# EAGLE design YamakenMusicPlayer (EAGLE 9.3.1)
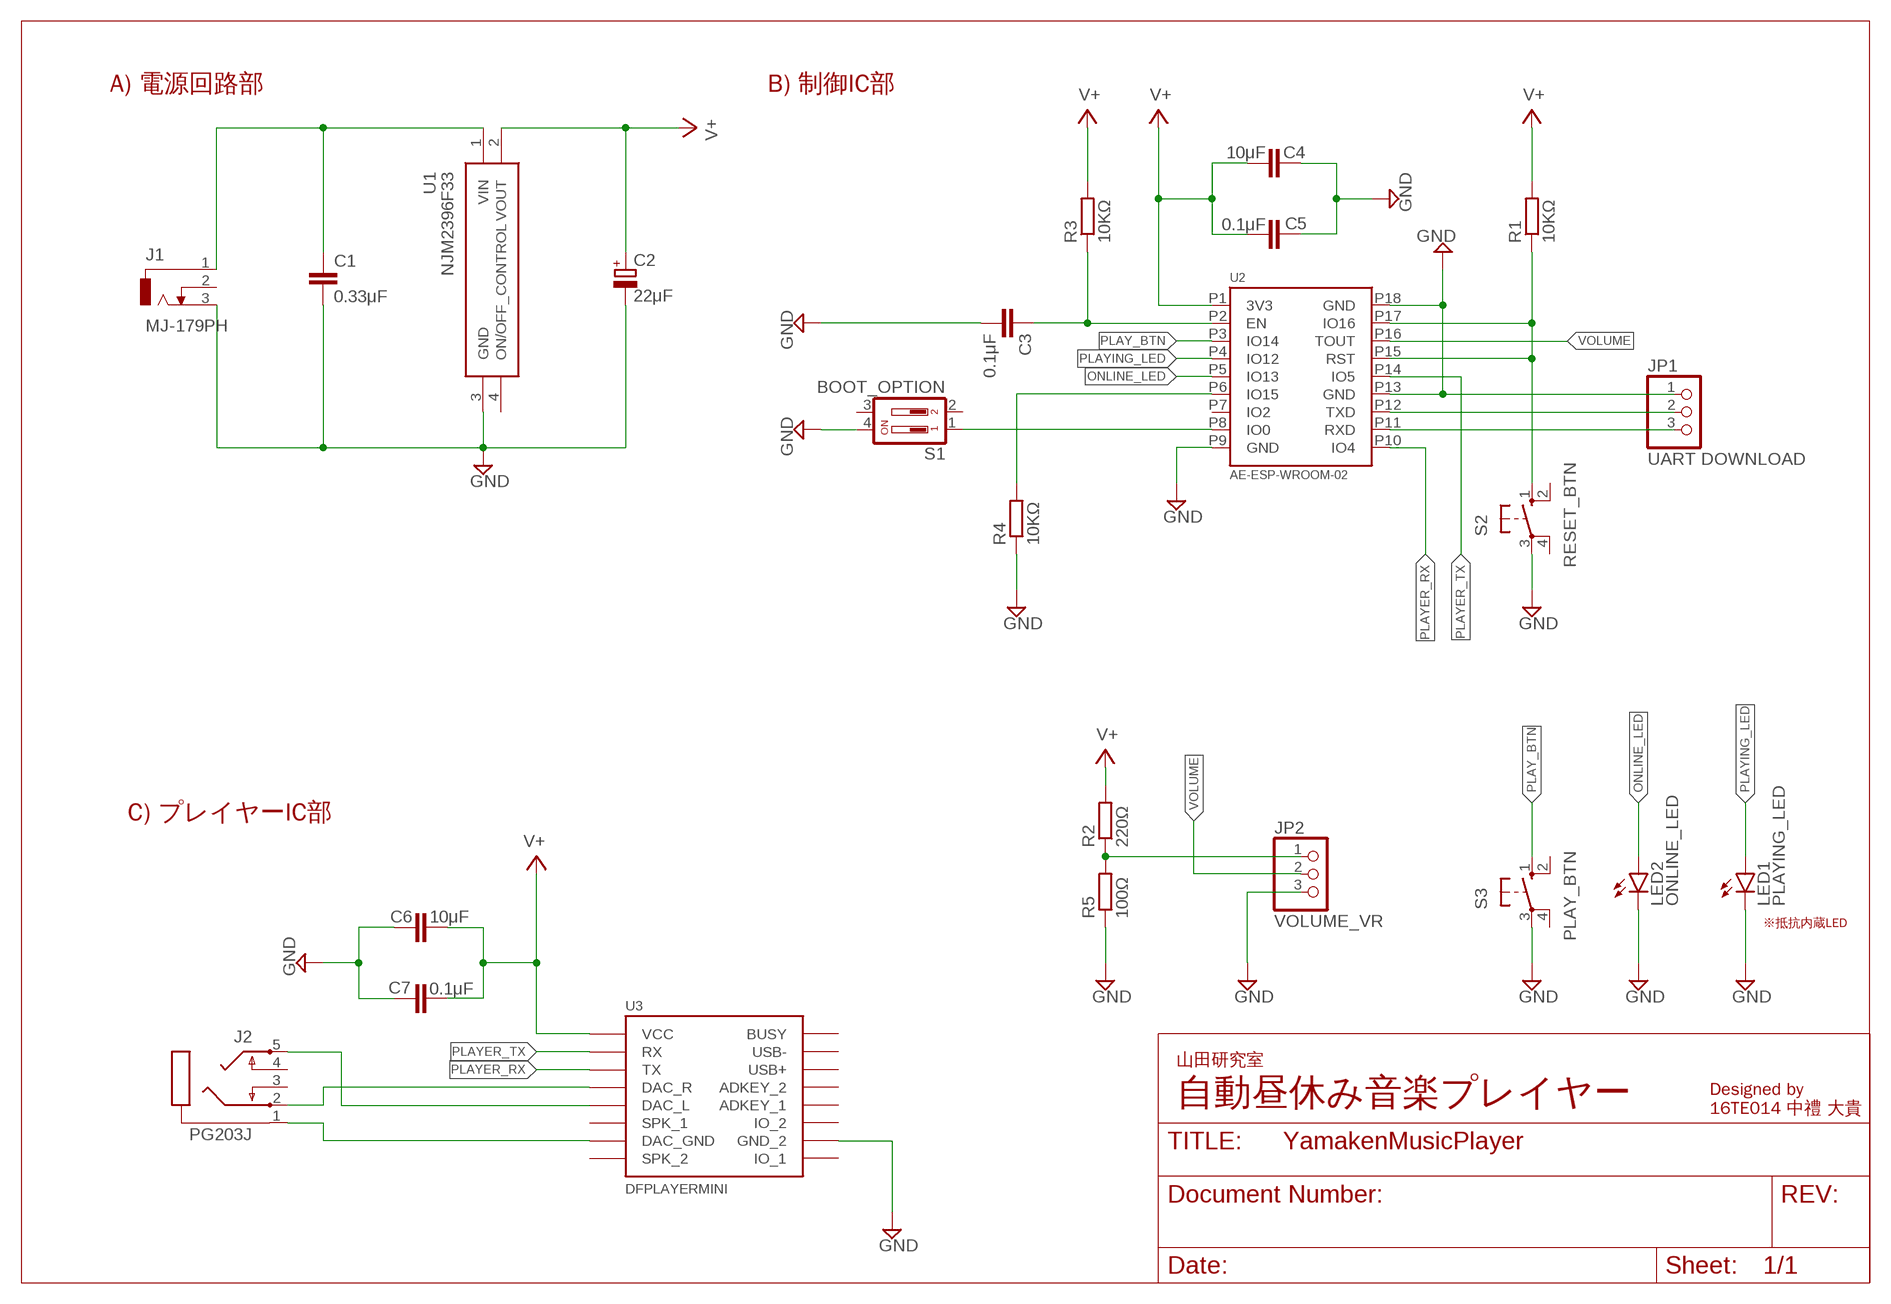
[diagram p0: schematic, sheet 1]
FRAME1 (DINA4_L): SPICEPREFIX: X

## Parts
C1  0.33μF  C-EU050-024X044  [C050-024X044]
C2  22μF  CPOL-EUE2.5-7  [E2,5-7]
C3  0.1μF  C-EU050-024X044  [C050-024X044]
C4  10μF  C-EU050-024X044  [C050-024X044]
C5  0.1μF  C-EU050-024X044  [C050-024X044]
C6  10μF  C-EU050-024X044  [C050-024X044]
C7  0.1μF  C-EU050-024X044  [C050-024X044]
J1  MJ-179PH  DCJ0202  [DCJ0202]
J2  PG203J  [PG203J]
JP1  UART DOWNLOAD  PINHD-1X3  [1X03]
JP2  VOLUME_VR  PINHD-1X3  [1X03]
LED1  PLAYING_LED  LED5MM  [LED5MM]
LED2  ONLINE_LED  LED5MM  [LED5MM]
R1  10KΩ  R-EU_0207/10  [0207/10]
R2  220Ω  R-EU_0207/10  [0207/10]
R3  10KΩ  R-EU_0207/10  [0207/10]
R4  10KΩ  R-EU_0207/10  [0207/10]
R5  100Ω  R-EU_0207/10  [0207/10]
S1  BOOT_OPTION  DIP02YL  [DIP02YL]
S2  RESET_BTN  10-XX  [B3F-10XX]
S3  PLAY_BTN  10-XX  [B3F-10XX]
U1  NJM2396F33  [TO254P480X1000X1900-4P]
U2  AE-ESP-WROOM-02  [AE-ESP-WROOM-02]
U3  DFPLAYERMINI  [DFPLAYERMINI]

## Nets
+12V [power]: C1.1 J1.1 U1.1(VIN)
DAC_GND: J2.1 U3.GND_1(DAC_GND)
DAC_R: J2.2 U3.DAC_R
GND [power]: C1.2 C2.- C3.2 C4.1 C5.1 C6.1 C7.1 J1.3 JP1.1 JP2.3 LED1.K(C) LED2.K(C) R4.1 R5.1 S1.4 S2.3(P) S3.3(P) U1.3(GND) U2.P9(GND) U2.P13(GND) U2.P18(GND) U3.GND_2
N$1: R1.1 S2.1(S) U2.P15(RST) U2.P17(IO16)
N$2: J2.5 U3.DAC_L
N$3: C3.1 R3.1 U2.P2(EN)
N$4: S1.1 U2.P8(IO0)
N$5: R4.2 U2.P6(IO15)
N$6: JP1.2 U2.P12(TXD)
N$7: JP1.3 U2.P11(RXD)
N$12: JP2.1 R2.1 R5.2
ONLINE_LED: LED2.A U2.P5(IO13)
PLAY_BTN: S3.1(S) U2.P3(IO14)
PLAYER_RX: U2.P10(IO4) U3.TX
PLAYER_TX: U2.P14(IO5) U3.RX
PLAYING_LED: LED1.A U2.P4(IO12)
V+ [power]: C2.+ C4.2 C5.2 C6.2 C7.2 R1.2 R2.2 R3.2 U1.2(VOUT) U2.P1(3V3) U3.VCC
VOLUME: JP2.2 U2.P16(TOUT)
Unconnected: J1.2 J2.3 J2.4 S1.2 S1.3 S2.2(S1) S2.4(P1) S3.2(S1) S3.4(P1) U1.4(ON/OFF_CONTROL) U2.P7(IO2) U3.ADKEY1(ADKEY_1) U3.ADKEY2(ADKEY_2) U3.BUSY U3.IO1(IO_1) U3.IO2(IO_2) U3.SPK1(SPK_1) U3.SPK2(SPK_2) U3.USB+ U3.USB-

## Notes on the sheet
- A) 電源回路部 | B) 制御IC部
- C) プレイヤーIC部
- ※抵抗内蔵LED
- 山田研究室
- 自動昼休み音楽プレイヤー
- Designed by
  16TE014 中禮 大貴

## Library data of the parts
C1 C3-C7 = rcl:C-EU: CAPACITOR, European symbol; SPICEPREFIX: C
C2 = rcl:CPOL-EU: POLARIZED CAPACITOR, European symbol; SPICEPREFIX: C
J1 = con-jack:DCJ0202: DC POWER JACK Source: DCJ0202.pdf; OC_FARNELL: unknown; OC_NEWARK: unknown
J2 = con-hirschmann:PG203J: MIC/HEADPHONE JACK KS-S stereo microphone/headphone jack PG203JN (Schukat); OC_FARNELL: unknown; OC_NEWARK: unknown
JP1 JP2 = pinhead:PINHD-1X3: PIN HEADER
LED1 LED2 = led:LED: LED OSRAM: - CHIPLED LG R971, LG N971, LY N971, LG Q971, LY Q971, LO R971, LY R971 LH N974, LH R974 LS Q976, LO Q976, LY Q976 LO Q996 - Hyper CHIPLED LW Q18S LB Q993, LB Q99A, LB R99A - SideLED LS A670, LO A670, LY A670, LG A670, LP A670 LB A673, LV A673, LT A673, LW A673 LH A674 LY A675 LS A676, LA A676, LO A676, LY A676, LW A676 LS A679, LY A679, LG A679 - Hyper Micro SIDELED® LS Y876, LA Y876, LO Y876, LY Y876 LT Y87S - SmartLED LW L88C, LW L88S LB L89C, LB L89S, LG L890 LS L89K, LO L89K, LY L89K LS L896, LA L896, LO L896, LY L896 - TOPLED LS T670, LO T670, LY T670, LG T670, LP T670 LSG T670, LSP T670, LSY T670, LOP T670, LYG T670 LG T671, LOG T671, LSG T671 LB T673, LV T673, LT T673, LW T673 LH T674 LS T676, LA T676, LO T676, LY T676, LB T676, LH T676, LSB T676, LW T676 LB T67C, LV T67C, LT T67C, LS T67K, LO T67K, LY T67K, LW E67C LS E67B, LA E67B, LO E67B, LY E67B, LB E67C, LV E67C, LT E67C LW T67C LS T679, LY T679, LG T679 LS T770, LO T770, LY T770, LG T770, LP T770 LB T773, LV T773, LT T773, LW T773 LH T774 LS E675, LA E675, LY E675, LS T675 LS T776, LA T776, LO T776, LY T776, LB T776 LHGB T686 LT T68C, LB T68C - Hyper Mini TOPLED® LB M676 - Mini TOPLED Santana® LG M470 LS M47K, LO M47K, LY M47K Source: http://www.osram.convergy.de LUXEON: - LUMILED® LXK2-PW12-R00, LXK2-PW12-S00, LXK2-PW14-U00, LXK2-PW14-V00 LXK2-PM12-R00, LXK2-PM12-S00, LXK2-PM14-U00 LXK2-PE12-Q00, LXK2-PE12-R00, LXK2-PE12-S00, LXK2-PE14-T00, LXK2-PE14-U00 LXK2-PB12-K00, LXK2-PB12-L00, LXK2-PB12-M00, LXK2-PB14-N00, LXK2-PB14-P00, LXK2-PB14-Q00 LXK2-PR12-L00, LXK2-PR12-M00, LXK2-PR14-Q00, LXK2-PR14-R00 LXK2-PD12-Q00, LXK2-PD12-R00, LXK2-PD12-S00 LXK2-PH12-R00, LXK2-PH12-S00 LXK2-PL12-P00, LXK2-PL12-Q00, LXK2-PL12-R00 Source: www.luxeon.com KINGBRIGHT: KA-3528ASYC Source: www.kingbright.com
R1-R5 = rcl:R-EU_: RESISTOR, European symbol; SPICEPREFIX: R
S1 = switch-dil:DIP02YL: DIL/CODE SWITCH; OC_FARNELL: unknown; OC_NEWARK: unknown
S2 S3 = switch-omron:10-XX: OMRON SWITCH; MPN: B3F-1000; OC_FARNELL: 176432; OC_NEWARK: 36M3542
U1 = SamacSys_Parts:NJM2396F33: LOW DROPOUT VOLTAGE REGULATOR WITH ON/OFF CONTROL Source: Datasheet <http://www.njr.com/semicon/PDF/NJM2396_E.pdf>; DESCRIPTION: LOW DROPOUT VOLTAGE REGULATOR WITH ON/OFF CONTROL; HEIGHT: 4.8mm; MANUFACTURER_NAME: New Japan Radio; MANUFACTURER_PART_NUMBER: NJM2396F33; RS_PART_NUMBER: 1782325; RS_PRICE-STOCK: http://uk.rs-online.com/web/p/products/1782325
U2 = ae-esp-wroom:AE-ESP-WROOM-02
U3 = DFPlayer_v1:DFPLAYERMINI

## Net classes
0 default: width 0.508 mm, clearance 0.508 mm
1 power: width 0.762 mm, clearance 0.508 mm

## Board
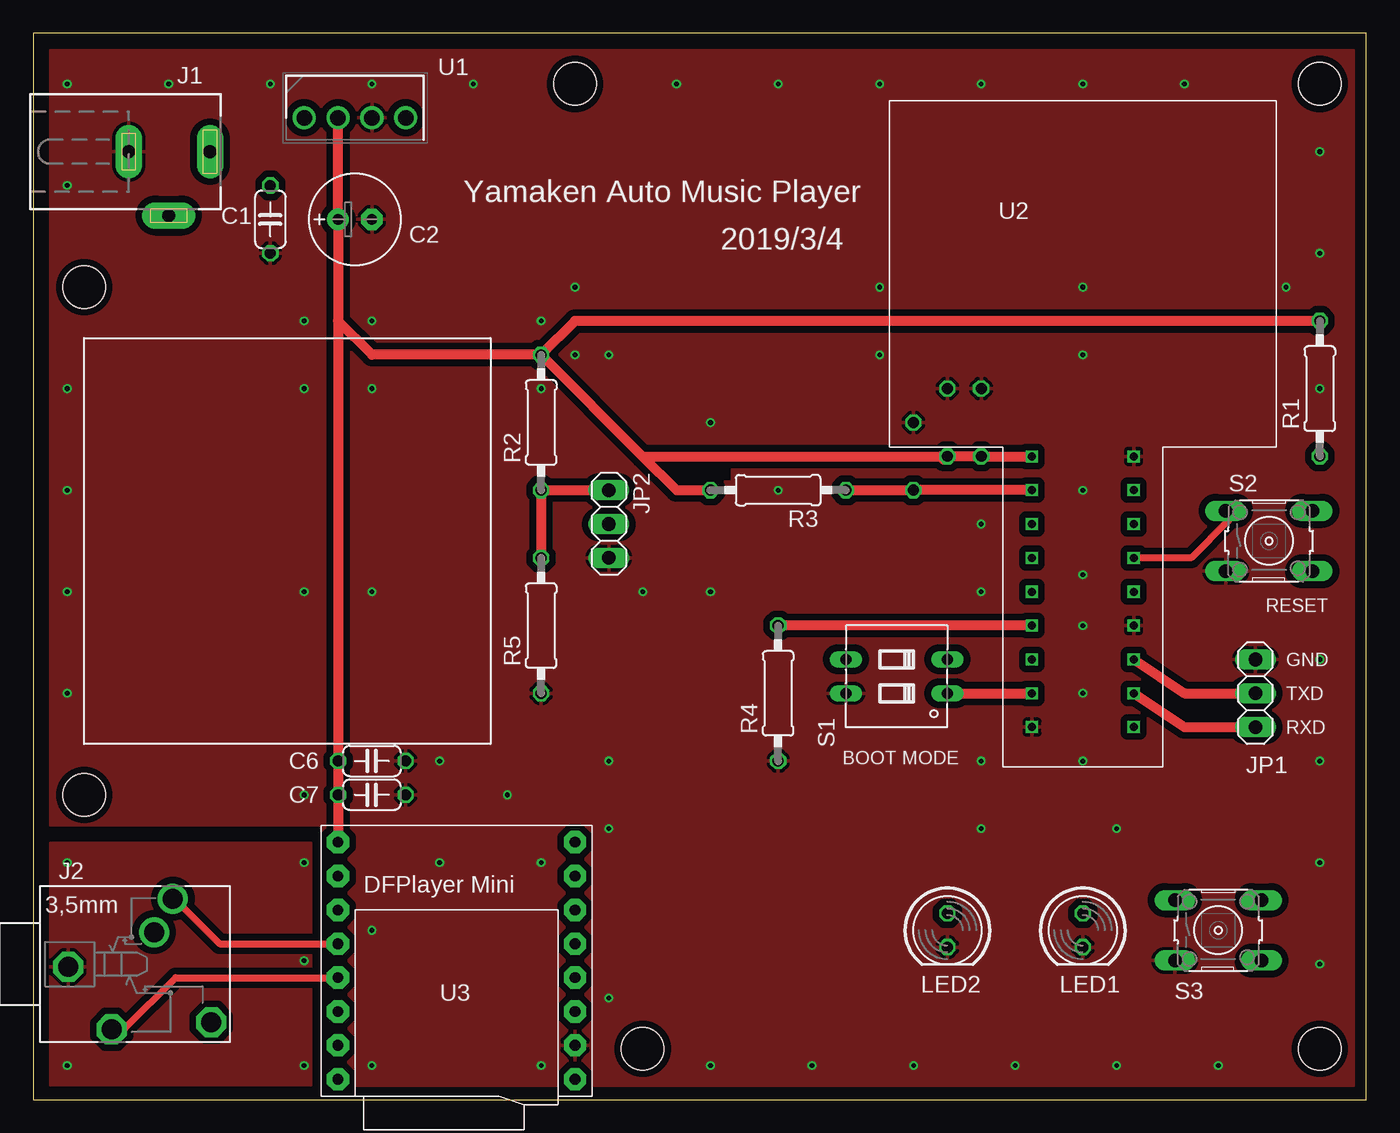
[diagram p1: board, top side]
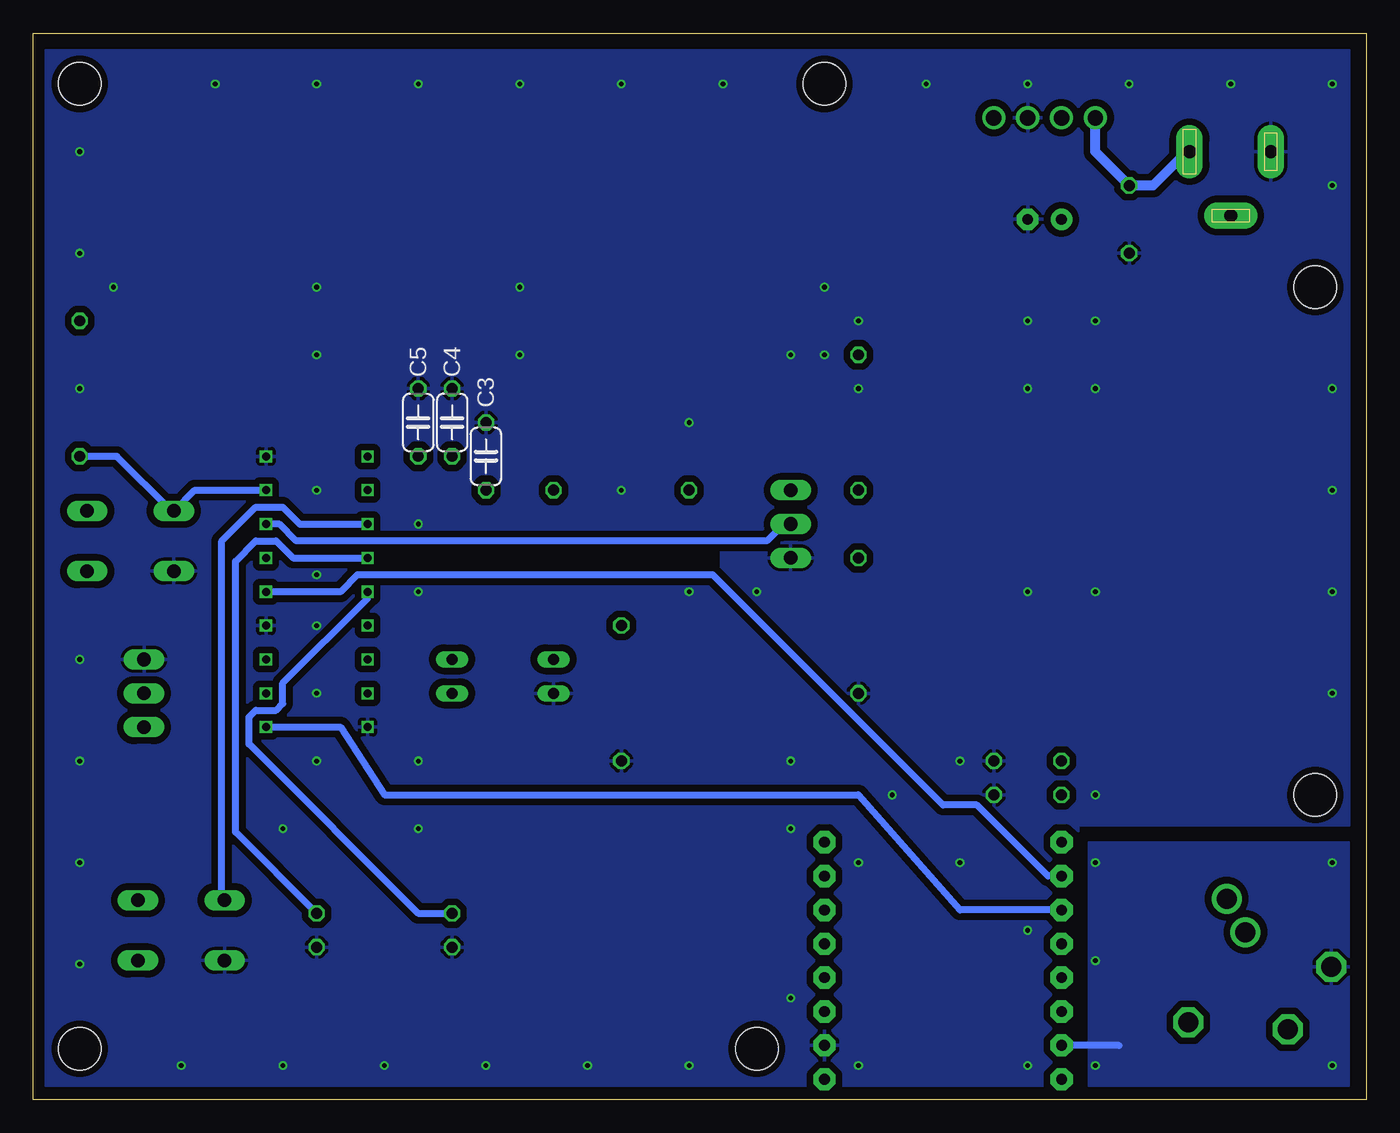
[diagram p2: board, bottom side, seen from below]

Size 100 x 80 mm. Coordinates in mm from the lower left corner, seen from the top.
Outline: 0,0 100,0 100,80 0,80 0,0
Copper layers (1*16): Top 0.035mm / dielectric 1.6mm / Bottom 0.035mm
Design rules "Elecrow_2-layer_PCB_eagle_rule": minimum track width 6mil, minimum drill 12mil, track to track 6mil, track to pad 6mil, pad to pad 6mil, via to via 8mil, smd to smd 0mil, copper to edge 20mil, drill to drill 10mil, minimum pad ring 6mil, minimum via ring 6mil, stop-mask expansion 0mil, vias tented up to drill 100mil, thermal gap 10mil
Holes 3.2 mm at 96.52,76.2 3.81,60.96 45.72,3.81 3.81,22.86 40.64,76.2 96.52,3.81
tRestrict: area 48,46.5 to 52.3,47.5
bRestrict: area 48.5,39.9 to 74.2,41.4

### Footprints (pad centres in the part's own frame; a part is rotated, then mirrored left to right if it is on the bottom)
C050-024X044 = drill 0.813 octagon: 1 -2.54,0; 2 2.54,0
E2,5-7 = drill 0.813 pad 1.6: + -1.27,0 | drill 0.813 pad 1.6 octagon: - 1.27,0
DCJ0202 = drill 1 pad 2 long: 1 0,3.1; 2 4.8,0; 3 0,-3
PG203J = drill 1.499 octagon: 1 -5.004,-0.203; 4 5.74,-4.369; 5 -1.753,-4.902 | drill 1.499: 2 2.845,4.902; 3 1.448,2.388
1X03 = drill 1.016 long: 1 -2.54,0; 2 0,0; 3 2.54,0
LED5MM = drill 0.813 octagon: A -1.27,0; K 1.27,0
0207/10 = drill 0.813 octagon: 1 -5.08,0; 2 5.08,0
DIP02YL = drill 0.813 long: 1 -1.27,-3.81; 2 1.27,-3.81; 3 1.27,3.81; 4 -1.27,3.81
B3F-10XX = drill 1.016 long: 1 -3.251,2.261; 2 3.251,2.261; 3 -3.251,-2.261; 4 3.251,-2.261
TO254P480X1000X1900-4P = drill 1.16 pad 1.74: 1 0,0; 2 2.54,0; 3 5.08,0; 4 7.62,0
AE-ESP-WROOM-02 = drill 0.6 pad 0.9 square: P1 -3.81,20.32; P2 -3.81,17.78; P3 -3.81,15.24; P4 -3.81,12.7; P5 -3.81,10.16; P6 -3.81,7.62; P7 -3.81,5.08; P8 -3.81,2.54; P9 -3.81,0; P10 3.81,0; P11 3.81,2.54; P12 3.81,5.08; P13 3.81,7.62; P14 3.81,10.16; P15 3.81,12.7; P16 3.81,15.24; P17 3.81,17.78; P18 3.81,20.32
DFPLAYERMINI = drill 0.8 pad 1.676 octagon: ADKEY1 8.89,-1.27; ADKEY2 8.89,1.27; BUSY 8.89,8.89; DAC_L -8.89,-1.27; DAC_R -8.89,1.27; GND_1 -8.89,-6.35; GND_2 8.89,-6.35; IO1 8.89,-8.89; IO2 8.89,-3.81; RX -8.89,6.35; SPK1 -8.89,-3.81; SPK2 -8.89,-8.89; TX -8.89,3.81; USB+ 8.89,3.81; USB- 8.89,6.35; VCC -8.89,8.89

### Placement (x,y rotation side)
C1  17.78,66.04 270 top
C2  24.13,66.04 0 top
C3  66.04,48.26 90 bottom
C4  68.58,50.8 270 bottom
C5  71.12,50.8 270 bottom
C6  25.4,25.4 180 top
C7  25.4,22.86 180 top
J1  10.16,71.12 270 top
J2  7.62,10.16 0 top
JP1  91.69,30.48 270 top
JP2  43.18,43.18 270 top
LED1  78.74,12.7 270 top
LED2  68.58,12.7 270 top
R1  96.52,53.34 90 top
R2  38.1,50.8 90 top
R3  55.88,45.72 180 top
R4  55.88,30.48 90 top
R5  38.1,35.56 90 top
S1  64.77,31.75 90 top
S2  92.71,41.91 0 top
S3  88.9,12.7 0 top
U1  20.32,73.66 0 top
U2  78.74,27.94 0 top
U3  31.75,10.41 0 top

### Tracks (layer width: path | path; a pad name or v marks a point on that pad's centre or on a via)
+12V
  Bottom 0.762: J1.1 13.46,71.12 16,68.58 C1.1 20.32,71.12 U1.1
DAC_GND  (via drill 0.35)
  Bottom 0.508: 18.54,4.06 U3.GND_1
  other vias: 20.32,10.41 20.32,2.54 20.32,17.78 2.54,17.78 2.54,2.54
  pour Top: 1.27,19.3 20.83,19.3 20.83,1.02 1.27,1.02
  pour Bottom: 1.27,19.3 20.83,19.3 20.83,1.02 1.27,1.02
DAC_R
  Top 0.508: U3.DAC_R 13.97,11.68 10.67,14.99 J2.2
GND  (via drill 0.35)
  other vias: 25.4,58.42 78.74,45.72 78.74,35.56 78.74,25.4 50.8,38.1 71.12,38.1 78.74,30.48 35.56,22.86 93.98,60.96 25.4,53.34 43.18,55.88 30.48,17.78 38.1,17.78 25.4,12.7 25.4,2.54 38.1,2.54 43.18,20.32 81.28,20.32 38.1,53.34 50.8,50.8 63.5,55.88 20.32,58.42 20.32,53.34 40.64,55.88 30.48,25.4 63.5,60.96 2.54,30.48 2.54,38.1 2.54,45.72 2.54,53.34 2.54,68.58 2.54,76.2 10.16,76.2 17.78,76.2 25.4,76.2 33.02,76.2 48.26,76.2 55.88,76.2 63.5,76.2 71.12,76.2 78.74,76.2 86.36,76.2 96.52,71.12 96.52,63.5 96.52,53.34 96.52,33.02 96.52,25.4 96.52,10.16 88.9,2.54 81.28,2.54 73.66,2.54 66.04,2.54 58.42,2.54 50.8,2.54 20.32,22.86 20.32,38.1 25.4,38.1 45.72,38.1 71.12,20.32 71.12,25.4 43.18,25.4 78.74,39.37 78.74,55.88 78.74,60.96 38.1,58.42 96.52,17.78 43.18,7.62 40.64,60.96 55.88,45.72 71.12,43.18
  pour Top: 1.27,78.74 1.27,20.57 21.59,20.57 21.59,1.02 99.06,1.02 99.06,78.74
  pour Bottom: 1.27,78.74 1.27,20.57 21.59,20.57 21.59,1.02 99.06,1.02 99.06,78.74
  pour Top: 76.2,50.8 81.28,50.8 81.28,25.4 76.2,25.4
  pour Top: 25.4,20.32 25.4,2.54 38.1,2.54 38.1,20.32
N$1
  Top 0.508: U2.P15 86.87,40.64 89.66,43.43 89.66,43.94 S2.1
  Bottom 0.508: U2.P17 87.88,45.72 89.41,44.2 S2.1 89.66,44.2 93.73,48.26 R1.1
N$2
  Top 0.508: U3.DAC_L 10.67,9.14 6.86,5.33 6.1,5.33 J2.5
N$3
  Top 0.762: U2.P2 C3.1 R3.1
N$4
  Top 0.762: S1.1 U2.P8
N$5
  Top 0.762: U2.P6 R4.2
N$6
  Top 0.762: U2.P12 86.36,30.48 JP1.2
N$7
  Top 0.762: U2.P11 86.36,27.94 JP1.3
N$12
  Top 0.762: R5.2 R2.1 JP2.1
ONLINE_LED
  Bottom 0.508: U2.P5 74.93,37.59 81.28,31.24 81.28,29.72 81.79,29.21 83.31,29.21 83.82,28.7 83.82,26.67 71.12,13.97 LED2.A
PLAY_BTN
  Bottom 0.508: U2.P3 80.01,43.18 81.28,44.45 83.31,44.45 85.85,41.91 85.85,14.99 S3.1
PLAYER_RX
  Bottom 0.508: U2.P10 76.96,27.94 73.66,22.86 38.1,22.86 30.48,14.22 U3.TX
PLAYER_TX
  Bottom 0.508: U2.P14 76.96,38.1 75.69,39.37 49.02,39.37 31.75,22.1 29.21,22.1 23.88,16.76 U3.RX
PLAYING_LED
  Bottom 0.508: U2.P4 80.52,40.64 81.79,41.91 83.31,41.91 84.84,40.39 84.84,20.07 LED1.A
V+
  Top 0.762: 22.86,58.42 C2.+ U1.2 | U2.P1 C5.2 C4.2 68.33,48.01 68.07,48.26 45.72,48.26 | R2.2 45.72,48.26 | R1.2 40.64,58.42 R2.2 | 22.86,58.42 C6.2 C7.2 U3.VCC | R2.2 25.4,55.88 22.86,58.42 | 45.72,48.26 48.26,45.72 R3.2
VOLUME
  Bottom 0.508: U2.P16 81.53,43.18 80.26,41.91 44.96,41.91 43.69,43.18 JP2.2

### Text on the board
tNames: Yamaken Auto Music Player | 2019/3/4 | RESET | GND | TXD | RXD | BOOT MODE | U3